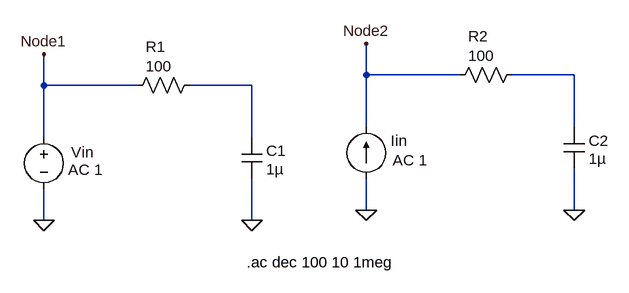
[diagram p0: schematic Admittance.asc]
Admittance.asc, the LTspice schematic file:
Version 4
SHEET 1 880 680
WIRE 400 160 400 112
WIRE 544 160 400 160
WIRE 720 160 624 160
WIRE -96 176 -96 128
WIRE 48 176 -96 176
WIRE 224 176 128 176
WIRE 400 240 400 160
WIRE 720 240 720 160
WIRE -96 256 -96 176
WIRE 224 256 224 176
WIRE 400 368 400 320
WIRE 720 368 720 304
WIRE -96 384 -96 336
WIRE 224 384 224 320
FLAG 224 384 0
FLAG -96 384 0
FLAG -96 128 Node1
FLAG 720 368 0
FLAG 400 368 0
FLAG 400 112 Node2
SYMBOL res 144 160 R90
WINDOW 0 -28 68 VBottom 0
WINDOW 3 -29 63 VTop 0
SYMATTR InstName R1
SYMATTR Value 100
SYMBOL cap 208 256 R0
WINDOW 0 38 21 Left 0
WINDOW 3 38 49 Left 0
SYMATTR InstName C1
SYMATTR Value 1µ
SYMBOL voltage -96 240 R0
WINDOW 0 42 39 Left 0
WINDOW 123 37 66 Left 0
WINDOW 39 0 0 Left 0
SYMATTR InstName Vin
SYMATTR Value2 AC 1
SYMATTR Value ""
SYMBOL res 640 144 R90
WINDOW 0 -28 68 VBottom 0
WINDOW 3 -29 63 VTop 0
SYMATTR InstName R2
SYMATTR Value 100
SYMBOL cap 704 240 R0
WINDOW 0 38 21 Left 0
WINDOW 3 38 49 Left 0
SYMATTR InstName C2
SYMATTR Value 1µ
SYMBOL current 400 320 R180
WINDOW 0 -63 59 Left 0
WINDOW 3 42 30 Left 0
WINDOW 123 -94 29 Left 0
WINDOW 39 0 0 Left 0
SYMATTR InstName Iin
SYMATTR Value ""
SYMATTR Value2 AC 1
TEXT 216 448 Left 0 !.ac dec 100 10 1meg

The netlist it stands for:
* Admittance.asc
R1 N002 Node1 100
C1 N002 0 1µ
Vin Node1 0 AC 1
R2 N001 Node2 100
C2 N001 0 1µ
Iin 0 Node2 AC 1
.ac dec 100 10 1meg
.backanno
.end